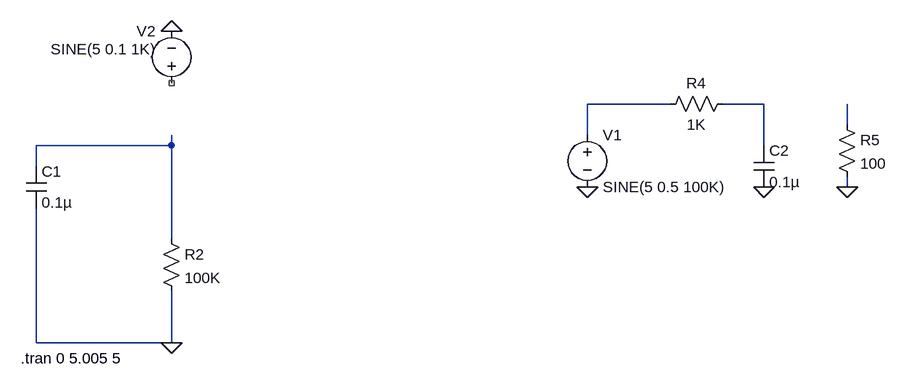
[diagram p0: schematic Photo_Resistor_Low_Pass_Filter_Simulation.asc]
Photo_Resistor_Low_Pass_Filter_Simulation.asc, the LTspice schematic file:
Version 4
SHEET 1 1060 680
WIRE 720 160 592 160
WIRE 864 160 800 160
WIRE 992 192 992 160
WIRE 592 208 592 160
WIRE -48 224 -48 208
WIRE -48 224 -256 224
WIRE 864 224 864 160
WIRE -256 256 -256 224
WIRE 992 288 992 272
WIRE -48 368 -48 224
WIRE -256 528 -256 320
WIRE -48 528 -48 448
WIRE -48 528 -256 528
FLAG -48 528 0
FLAG -48 48 0
FLAG 592 288 0
FLAG 864 288 0
FLAG 992 288 0
SYMBOL cap -272 256 R0
SYMATTR InstName C1
SYMATTR Value 0.1µ
SYMATTR SpiceLine IC=0
SYMBOL res -64 352 R0
SYMATTR InstName R2
SYMATTR Value 100K
SYMBOL voltage -48 144 R180
WINDOW 0 24 96 Left 2
WINDOW 3 24 68 Left 2
WINDOW 123 0 0 Left 0
WINDOW 39 0 0 Left 0
SYMATTR InstName V2
SYMATTR Value SINE(5 0.1 1K)
SYMBOL voltage 592 192 R0
WINDOW 123 0 0 Left 0
WINDOW 39 0 0 Left 0
SYMATTR InstName V1
SYMATTR Value SINE(5 0.5 100K)
SYMBOL res 816 144 R90
WINDOW 0 0 56 VBottom 2
WINDOW 3 32 56 VTop 2
SYMATTR InstName R4
SYMATTR Value 1K
SYMBOL cap 848 224 R0
SYMATTR InstName C2
SYMATTR Value 0.1µ
SYMBOL res 976 176 R0
SYMATTR InstName R5
SYMATTR Value 100
TEXT -280 552 Left 2 !.tran 0 5.005 5

The netlist it stands for:
* Photo_Resistor_Low_Pass_Filter_Simulation.asc
C1 N004 0 0.1µ IC=0
R2 N004 0 100K
V2 NC_01 0 SINE(5 0.1 1K)
V1 N001 0 SINE(5 0.5 100K)
R4 N002 N001 1K
C2 N002 0 0.1µ
R5 N003 0 100
.tran 0 5.005 5
.backanno
.end